# Altium schematic sheet Radio.SchDoc
size A4; SheetNumber: 3; SheetTotal: 7
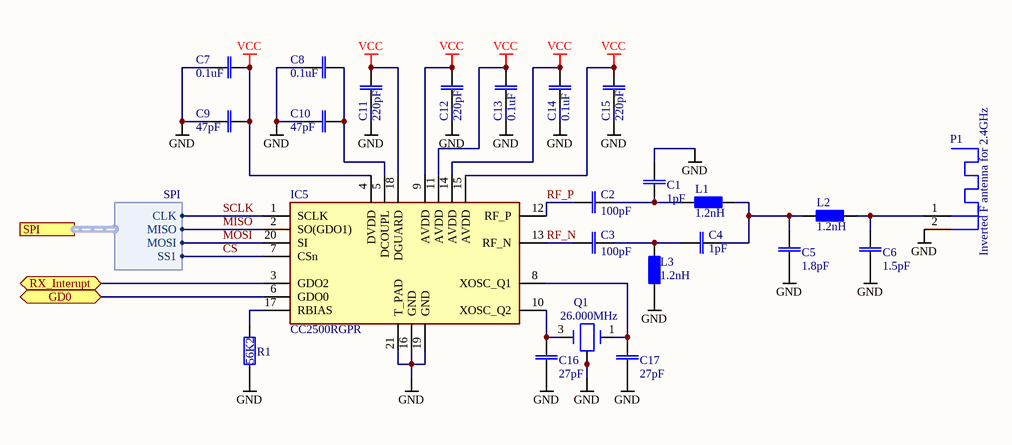
[diagram p0: Radio.SchDoc]

## Parts
C1  1pF  [CAP0402]
C2  100pF  [CAP0402]
C3  100pF  [CAP0402]
C4  1pF  [CAP0402]
C5  1.8pF  [CAP0402]
C6  1.5pF  [CAP0402]
C7  0.1uF  [CAP0402]
C8  0.1uF  [CAP0402]
C9  47pF  [CAP0402]
C10  47pF  [CAP0402]
C11  220pF  [CAP0402]
C12  220pF  [CAP0402]
C13  0.1uF  [CAP0402]
C14  0.1uF  [CAP0402]
C15  220pF  [CAP0402]
C16  27pF  [CAP0402]
C17  27pF  [CAP0402]
IC5  CC2500RGPR  [QFN20_4X4(CC2500)]
L1  1.2nH  [IND0402]
L2  1.2nH  [IND0402]
L3  1.2nH  [IND0402]
P1  Inverted F antenna for 2.4GHz  [Inverted_F_Antenna_2400MHZ]  (net tie, no BOM)
Q1  26.000MHz  [OSCCC322507]
R1  56K2  [RES0402]  (value not drawn)

## Ports
GD0 (bidir), RX_Interupt (bidir), SPI (harness SPI)

## Harnesses
SPI: MOSI, MISO, CLK, SS1

## Nets
GND: C1.1 C5.2 C6.2 C7.1 C8.1 C9.1 C10.1 C11.1 C12.1 C13.1 C14.1 C15.1 C16.2 C17.2 IC5.16(GND) IC5.19(GND) IC5.21(T_PAD) L3.1 P1.2(REF) Q1.2 Q1.4 R1.1
VCC: C7.2 C9.2 C11.2 C12.2 C13.2 C14.2 C15.2 IC5.4(DVDD) IC5.9(AVDD) IC5.11(AVDD) IC5.14(AVDD) IC5.15(AVDD) IC5.18(DGUARD)
CS: IC5.7(CSn) ; port SPI.SS1
GD0: IC5.6(GDO0) ; port GD0
MISO: IC5.2(SO(GDO1)) ; port SPI.MISO
MOSI: IC5.20(SI) ; port SPI.MOSI
RF_N: C3.1 IC5.13(RF_N)
RF_P: C2.1 IC5.12(RF_P)
RX_Interupt: IC5.3(GDO2) ; port RX_Interupt
SCLK: IC5.1(SCLK) ; port SPI.CLK
NetC1_2: C1.2 C2.2 L1.1
NetC3_2: C3.2 C4.2 L3.2
NetC4_1: C4.1 C5.1 L1.2 L2.1
NetC6_1: C6.1 L2.2 P1.1(FEED)
NetC8_2: C8.2 C10.2 IC5.5(DCOUPL)
NetC16_1: C16.1 IC5.10(XOSC_Q2) Q1.3
NetC17_1: C17.1 IC5.8(XOSC_Q1) Q1.1
NetIC5_17: IC5.17(RBIAS) R1.2

## Library data of the parts
C1 C4 = CAP_0402: Manufacturer: Samsung Electro-Mechanics; Manufacturer Partnummber: CL05C010CB5NNNC; Value: 1pF
C2 C3 = CAP_0402: Manufacturer: Samsung Electro-Mechanics; Manufacturer Partnummber: CL05C101JB5NNNC; Value: 100pF
C5 = CAP_0402: Manufacturer: Samsung Electro-Mechanics; Manufacturer Partnummber: CL05C1R8CC51PNC; Value: 1.8pF
C6 = CAP_0402: Manufacturer: Samsung Electro-Mechanics; Manufacturer Partnummber: CL05C1R5BB5NNNC; Value: 1.5pF
C7 C8 C13 C14 = CAP_0402: Manufacturer: Samsung Electro-Mechanics; Manufacturer Partnummber: CL05A104KA5NNNC; Value: 0.1uF
C9 C10 = CAP_0402: Manufacturer: Samsung Electro-Mechanics; Manufacturer Partnummber: CL05C470JB5NNNC; Value: 47pF
C11 C12 C15 = CAP_0402: Manufacturer: Samsung Electro-Mechanics; Manufacturer Partnummber: CL05C221JB5NNNC; Value: 220pF
C16 C17 = CAP_0402: Manufacturer: Samsung Electro-Mechanics; Manufacturer Partnummber: CL05C270JB5NNNC; Value: 27pF
IC5 = CC2500: Manufacturer: Texas Instruments; Manufacturer Partnummber: CC2500RGPR
L1-L3 = IND_0402: Manufacturer: Abracon LLC; Manufacturer Partnummber: ATFC-0402-1N2B-T; Value: 1.2nH
P1 = Antenna F 2400MHz
Q1 = ABM8G-26.000MHZ-18-D2Y-T: Manufacturer: Abracon LLC; Manufacturer Partnummber: ABM8G-26.000MHZ-18-D2Y-T
R1 = RES_0402: Manufacturer: YAGEO; Manufacturer Partnummber: RC0402FR-0756K2L; Value: 56K2